# Altium schematic sheet Connectors.SchDoc
size A4; SheetNumber: 3; SheetTotal: 7
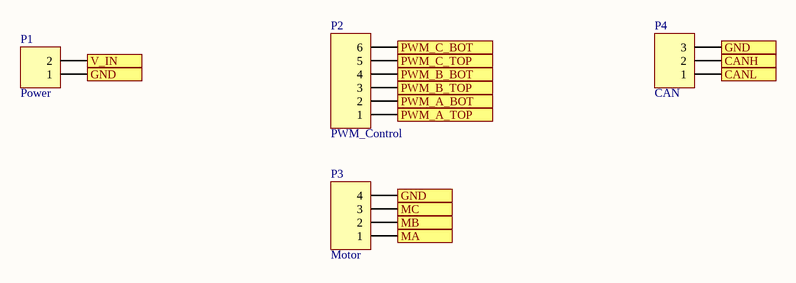
[diagram p0: Connectors.SchDoc]

## Parts
P1  Power  [HDR1X2]
P2  PWM_Control  [HDR1X6]
P3  Motor  [HDR1X4]
P4  CAN  [HDR1X3]

## Ports
CANH, CANL, GND, MA, MB, MC, PWM_A_BOT, PWM_A_TOP, PWM_B_BOT, PWM_B_TOP, PWM_C_BOT, PWM_C_TOP, V_IN

## Nets
CANH: P4.2 ; port CANH
CANL: P4.1 ; port CANL
GND: P1.1 P3.4 P4.3 ; port GND
MA: P3.1 ; port MA
MB: P3.2 ; port MB
MC: P3.3 ; port MC
PWM_A_BOT: P2.2 ; port PWM_A_BOT
PWM_A_TOP: P2.1 ; port PWM_A_TOP
PWM_B_BOT: P2.4 ; port PWM_B_BOT
PWM_B_TOP: P2.3 ; port PWM_B_TOP
PWM_C_BOT: P2.6 ; port PWM_C_BOT
PWM_C_TOP: P2.5 ; port PWM_C_TOP
V_IN: P1.2 ; port V_IN

## Library data of the parts
P1 = Header 2: Header, 2-Pin; LatestRevisionDate: 17-Jul-2002; LatestRevisionNote: Re-released for DXP Platform.; Publisher: Altium Limited
P2 = Header 6: Header, 6-Pin; LatestRevisionDate: 17-Jul-2002; LatestRevisionNote: Re-released for DXP Platform.; Publisher: Altium Limited
P3 = Header 4: Header, 4-Pin; LatestRevisionDate: 17-Jul-2002; LatestRevisionNote: Re-released for DXP Platform.; Publisher: Altium Limited
P4 = Header 3: Header, 3-Pin; LatestRevisionDate: 17-Jul-2002; LatestRevisionNote: Re-released for DXP Platform.; Publisher: Altium Limited